# EAGLE schematic v1 (EAGLE 7.3.0)
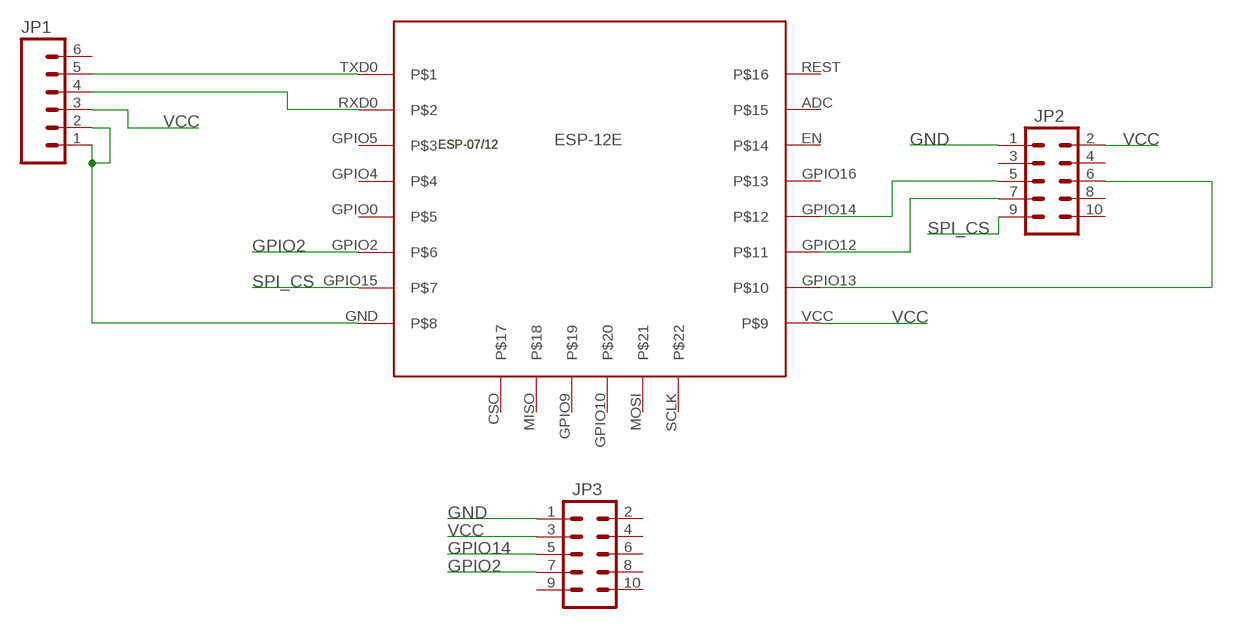
[diagram p0: schematic, sheet 1]

## Parts
JP1  M06SILK_FEMALE_PTH  [1X06]
JP2  M05X2PTH  [AVR_ICSP]
JP3  M05X2PTH  [AVR_ICSP]
U$1  ESP-07/12_ESP-12E  [ESP-07/12]

## Nets
GND: JP2.1 JP3.1
GPIO2: JP3.7 U$1.GPIO2
GPIO14: JP2.5 JP3.5 U$1.GPIO14
N$1: JP1.5 U$1.TXD0
N$2: JP1.4 U$1.RXD0
N$3: JP1.1 JP1.2 U$1.GND
N$5: JP2.7 U$1.GPIO12
N$6: JP2.6 U$1.GPIO13
SPI_CS: JP2.9 U$1.GPIO15
VCC: JP1.3 JP2.2 JP3.3 U$1.VCC
Unconnected: JP1.6 JP2.3 JP2.4 JP2.8 JP2.10 JP3.2 JP3.4 JP3.6 JP3.8 JP3.9 JP3.10 U$1.ADC U$1.CSO U$1.EN U$1.GPIO0 U$1.GPIO4 U$1.GPIO5 U$1.GPIO9 U$1.GPIO10 U$1.GPIO16 U$1.MISO U$1.MOSI U$1.REST U$1.SCLK

## Library data of the parts
JP1 = SparkFun-Connectors:M06: Header 6 Standard 6-pin 0.1" header. Use with straight break away headers (SKU : PRT-00116), right angle break away headers (PRT-00553), swiss pins (PRT-00743), machine pins (PRT-00117), and female headers (PRT-00115). Molex polarized connector foot print use with SKU : PRT-08094 with associated crimp pins and housings. NOTES ON THE VARIANTS LOCK and LOCK_LONGPADS... This footprint was designed to help hold the alignment of a through-hole component (i.e. 6-pin header) while soldering it into place. You may notice that each hole has been shifted either up or down by 0.005 of an inch from it's more standard position (which is a perfectly straight line). This slight alteration caused the pins (the squares in the middle) to touch the edges of the holes. Because they are alternating, it causes a "brace" to hold the component in place. 0.005 has proven to be the perfect amount of "off-center" position when using our standard breakaway headers. Although looks a little odd when you look at the bare footprint, once you have a header in there, the alteration is very hard to notice. Also,if you push a header all the way into place, it is covered up entirely on the bottom side. This idea of altering the position of holes to aid alignment will be further integrated into the Sparkfun Library for other footprints. It can help hold any component with 3 or more connection pins.; PROD_ID: CONN-08437
JP2 JP3 = SparkFun-Connectors:M05X2: Header 5x2 Standard 10-pin dual row 0.1" header. Commonly used with AVR-ISP. Use with Spark Fun Electronics SKU: PRT-00778
U$1 = ESP-12E:ESP-07/12: Version 1.0 of the library for the ESP-07/12 full GPIO dev board module byME Jon jonnyradu@gmail.com